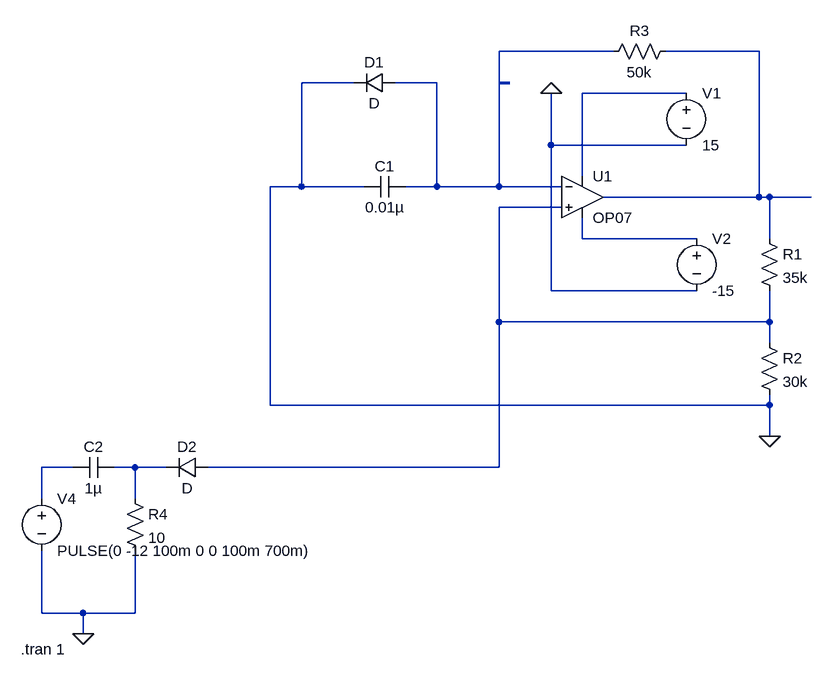
[diagram p0: schematic opamp-MonoStable.asc]
opamp-MonoStable.asc, the LTspice schematic file:
Version 4.1
SHEET 1 880 888
WIRE 176 -48 0 -48
WIRE 400 -48 256 -48
WIRE -224 0 -304 0
WIRE -96 0 -160 0
WIRE 0 0 0 -48
WIRE 288 16 128 16
WIRE 80 96 80 16
WIRE 288 96 80 96
WIRE 128 144 128 16
WIRE -304 160 -304 0
WIRE -304 160 -352 160
WIRE -208 160 -304 160
WIRE -96 160 -96 0
WIRE -96 160 -144 160
WIRE 0 160 0 0
WIRE 0 160 -96 160
WIRE 96 160 0 160
WIRE 400 176 400 -48
WIRE 400 176 160 176
WIRE 416 176 400 176
WIRE 480 176 416 176
WIRE 96 192 0 192
WIRE 128 240 128 208
WIRE 304 240 128 240
WIRE 416 240 416 176
WIRE 80 320 80 96
WIRE 304 320 80 320
WIRE 0 368 0 192
WIRE 416 368 416 320
WIRE 416 368 0 368
WIRE 416 400 416 368
WIRE -352 496 -352 160
WIRE 416 496 416 480
WIRE 416 496 -352 496
WIRE 416 544 416 496
WIRE -656 592 -704 592
WIRE -560 592 -592 592
WIRE -512 592 -560 592
WIRE 0 592 0 368
WIRE 0 592 -448 592
WIRE -704 640 -704 592
WIRE -560 640 -560 592
WIRE -704 816 -704 720
WIRE -640 816 -704 816
WIRE -560 816 -560 720
WIRE -560 816 -640 816
WIRE -640 848 -640 816
FLAG 80 16 0
FLAG 416 544 0
FLAG -640 848 0
BUSTAP 0 0 16 0
SYMBOL OpAmps\\OP07 128 112 R0
SYMATTR InstName U1
SYMBOL voltage 288 0 R0
WINDOW 123 0 0 Left 0
WINDOW 39 0 0 Left 0
SYMATTR InstName V1
SYMATTR Value 15
SYMBOL voltage 304 224 R0
WINDOW 123 0 0 Left 0
WINDOW 39 0 0 Left 0
SYMATTR InstName V2
SYMATTR Value -15
SYMBOL res 400 224 R0
SYMATTR InstName R1
SYMATTR Value 35k
SYMBOL res 400 384 R0
SYMATTR InstName R2
SYMATTR Value 30k
SYMBOL cap -144 144 R90
WINDOW 0 0 32 VBottom 2
WINDOW 3 32 32 VTop 2
SYMATTR InstName C1
SYMATTR Value 0.01µ
SYMBOL res 272 -64 R90
WINDOW 0 0 56 VBottom 2
WINDOW 3 32 56 VTop 2
SYMATTR InstName R3
SYMATTR Value 50k
SYMBOL diode -160 -16 R90
WINDOW 0 0 32 VBottom 2
WINDOW 3 32 32 VTop 2
SYMATTR InstName D1
SYMBOL voltage -704 624 R0
WINDOW 123 0 0 Left 0
WINDOW 39 0 0 Left 0
SYMATTR InstName V4
SYMATTR Value PULSE(0 -12 100m 0 0 100m 700m)
SYMBOL res -576 624 R0
SYMATTR InstName R4
SYMATTR Value 10
SYMBOL cap -592 576 R90
WINDOW 0 0 32 VBottom 2
WINDOW 3 32 32 VTop 2
SYMATTR InstName C2
SYMATTR Value 1µ
SYMBOL diode -448 576 R90
WINDOW 0 0 32 VBottom 2
WINDOW 3 32 32 VTop 2
SYMATTR InstName D2
TEXT -736 872 Left 2 !.tran 1

The netlist it stands for:
* opamp-MonoStable.asc
X§U1 N004 N001 N003 N005 N002 LT1001  ; OP07, pins In+ In- V+ V- OUT
V1 N003 0 15
V2 N005 0 -15
R1 N002 N004 35k
R2 N004 0 30k
C1 N001 0 0.01µ
R3 N002 N001 50k
D1 N001 0 D
V4 N006 0 PULSE(0 -12 100m 0 0 100m 700m)
R4 N007 0 10
C2 N007 N006 1µ
D2 N004 N007 D
.model D D
.lib standard.dio
.tran 1
.lib LTC.lib
.backanno
.end